# EAGLE design mh-z19b (EAGLE 9.6.2)
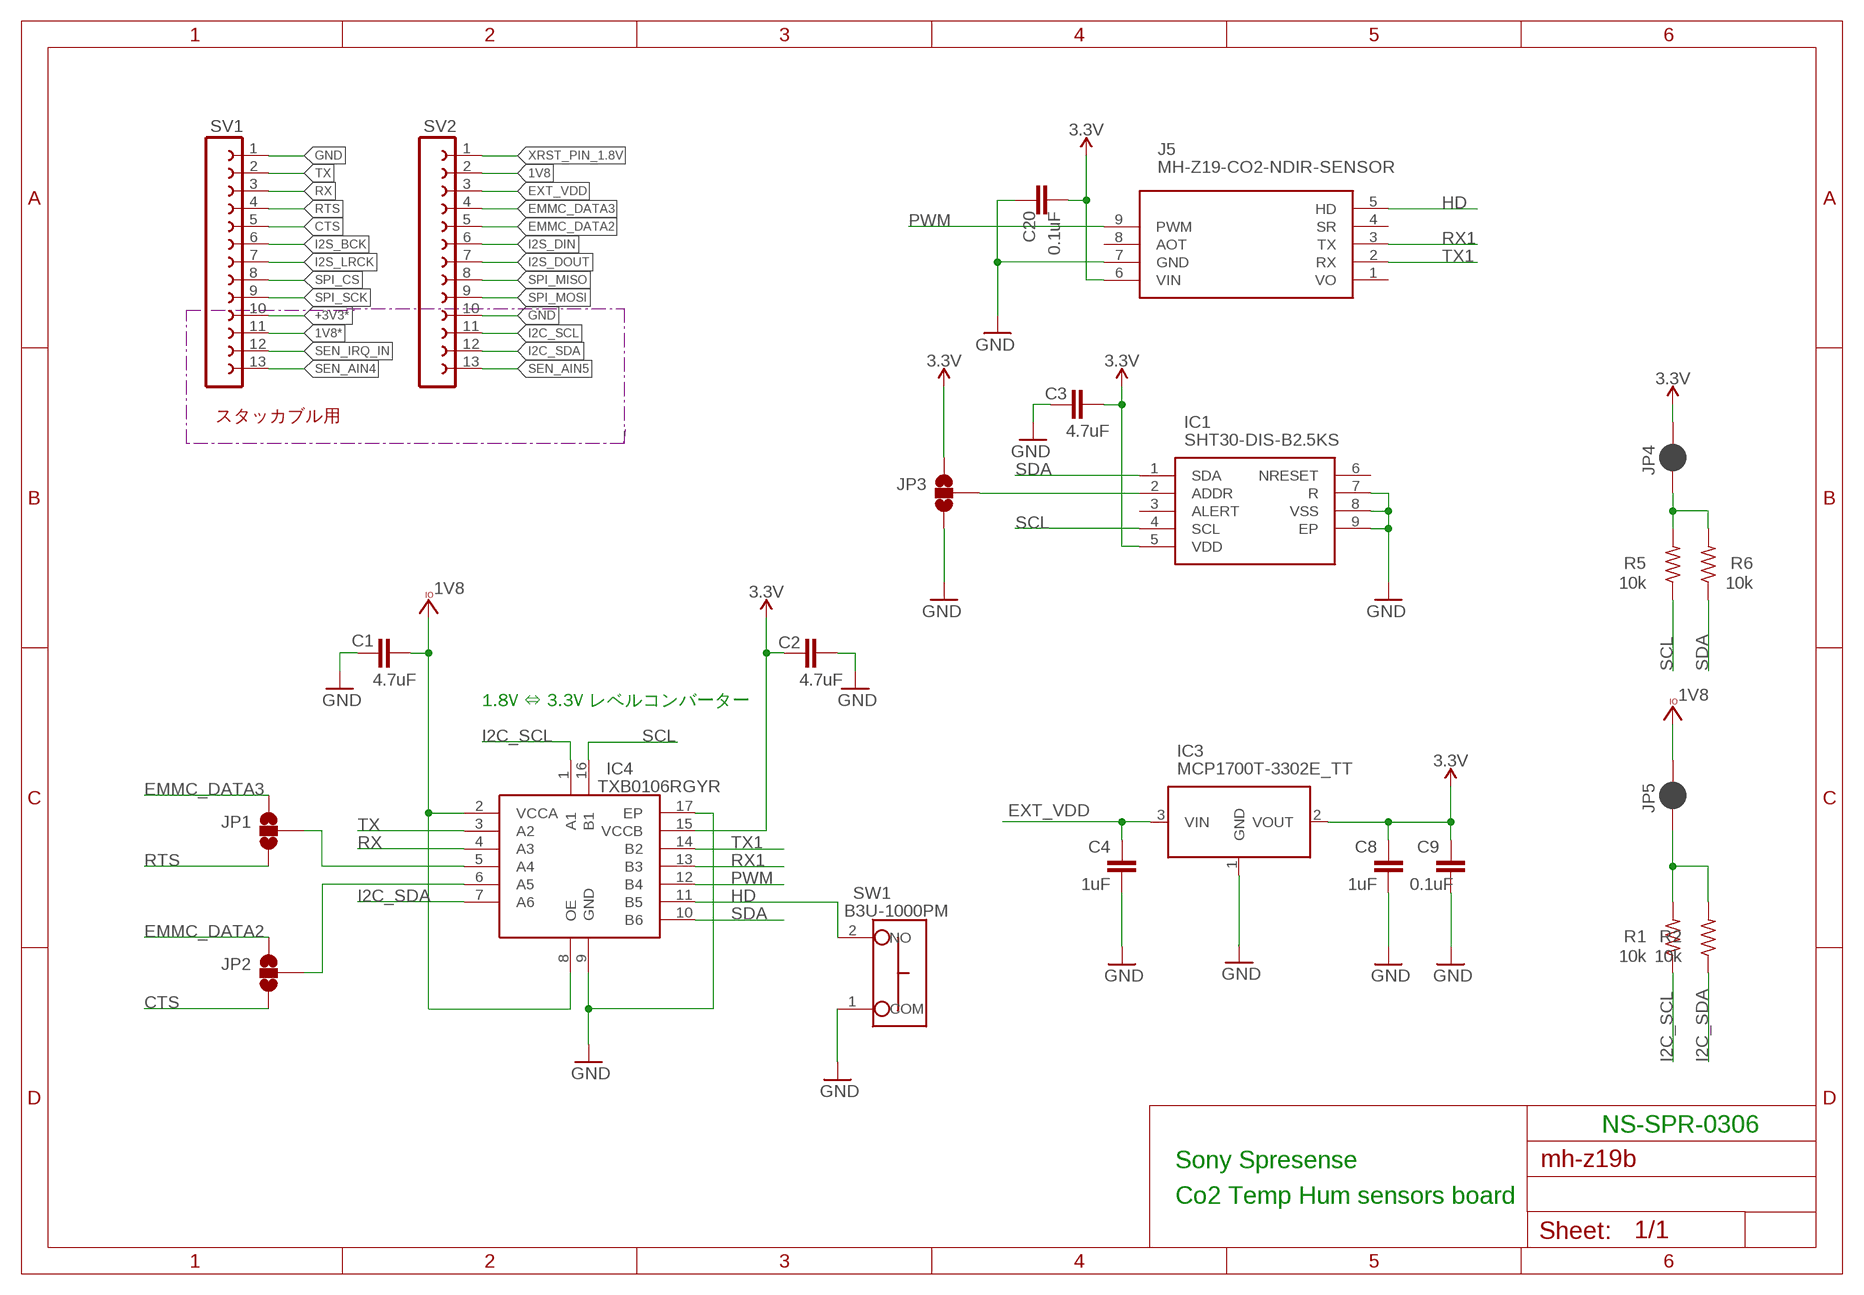
[diagram p0: schematic, sheet 1]

## Parts
C1  4.7uF  C-EUC0603K  [C0603K]
C2  4.7uF  C-EUC0603K  [C0603K]
C3  4.7uF  C-EUC0603K  [C0603K]
C4  1uF  C-EUC0603K  [C0603K]
C8  1uF  C-EUC0603K  [C0603K]
C9  0.1uF  C-EUC0603K  [C0603K]
C20  0.1uF  C-EUC0603K  [C0603K]
IC1  SHT30-DIS-B2.5KS  [SHT30DISB25KS]
IC3  MCP1700T-3302E_TT  [SOT95P237X112-3N]
IC4  TXB0106RGYR  [SN74CBT3257CRGYR]
J5  MH-Z19-CO2-NDIR-SENSOR  [MH-Z19]
JP1  JUMPER-SMT_3_NO_NO-SILK  [SMT-JUMPER_3_NO_NO-SILK]
JP2  JUMPER-SMT_3_NO_NO-SILK  [SMT-JUMPER_3_NO_NO-SILK]
JP3  JUMPER-SMT_3_NO_NO-SILK  [SMT-JUMPER_3_NO_NO-SILK]
JP4  JUMPER-SMT_2_NC_PASTE_NO-SILK  [SMT-JUMPER_2_NC_PASTE_NO-SILK]
JP5  JUMPER-SMT_2_NC_PASTE_NO-SILK  [SMT-JUMPER_2_NC_PASTE_NO-SILK]
R1  10k  R-US_R0603  [R0603]
R2  10k  R-US_R0603  [R0603]
R5  10k  R-US_R0603  [R0603]
R6  10k  R-US_R0603  [R0603]
SV1  FE13-1  [FE13]
SV2  FE13-1  [FE13]
SW1  B3U-1000PM  [B3U1000PM]

## Nets
1V8: C1.2 IC4.2(VCCA) IC4.8(OE) SV2.2
1V8*: SV1.11
3.3V: C2.1 C3.2 C8.1 C9.1 C20.2 IC1.5(VDD) IC3.2(VOUT) IC4.15(VCCB) J5.6(VIN) JP3.1 JP4.2
+3V3*: SV1.10
CTS: JP2.3 SV1.5
EMMC_DATA2: JP2.1 SV2.5
EMMC_DATA3: JP1.1 SV2.4
EXT_VDD: C4.1 IC3.3(VIN) SV2.3
GND: C1.1 C2.2 C3.1 C4.2 C8.2 C9.2 C20.1 IC1.7(R) IC1.8(VSS) IC1.9(EP) IC3.1(GND) IC4.9(GND) IC4.17(EP) J5.7(GND) JP3.3 SV1.1 SV2.10 SW1.1(COM)
HD: IC4.11(B5) J5.5(HD) SW1.2(NO)
I2C_SCL: IC4.1(A1) R1.1 SV2.11
I2C_SDA: IC4.7(A6) R2.1 SV2.12
I2S_BCK: SV1.6
I2S_DIN: SV2.6
I2S_DOUT: SV2.7
I2S_LRCK: SV1.7
N$1: IC4.5(A4) JP1.2
N$2: IC4.6(A5) JP2.2
N$4: JP4.1 R5.2 R6.2
N$5: JP5.1 R1.2 R2.2
N$7: IC1.2(ADDR) JP3.2
PWM: IC4.12(B4) J5.9(PWM)
RTS: JP1.3 SV1.4
RX: IC4.4(A3) SV1.3
RX1: IC4.13(B3) J5.3(TX)
SCL: IC1.4(SCL) IC4.16(B1) R5.1
SDA: IC1.1(SDA) IC4.10(B6) R6.1
SEN_AIN4: SV1.13
SEN_AIN5: SV2.13
SEN_IRQ_IN: SV1.12
SPI_CS: SV1.8
SPI_MISO: SV2.8
SPI_MOSI: SV2.9
SPI_SCK: SV1.9
TX: IC4.3(A2) SV1.2
TX1: IC4.14(B2) J5.2(RX)
VCCIO: JP5.2 ; supply symbol labelled 1V8
XRST_PIN_1.8V: SV2.1
Unconnected: IC1.3(ALERT) IC1.6(NRESET) J5.4(SR) J5.8(AOT)

## Notes on the sheet
- スタッカブル用
- 1.8V ⇔ 3.3V レベルコンバーター
- NS-SPR-0306
- Sony Spresense
- Co2 Temp Hum sensors board

## Power pins joined to a net without a drawn wire
VO: J5.1(VO)

## Library data of the parts
C1-C4 C8 C9 = rcl:C-EU: CAPACITOR, European symbol; SPICEPREFIX: C
C20 = resistor:C-EU: CAPACITOR, European symbol
IC1 = SamacSys_Parts:SHT30-DIS-B2.5KS: Humidity/Temperature Sensor Digital Serial (I2C) 8-Pin DFN EP T/R Source: Datasheet <https://media.digikey.com/pdf/Data Sheets/Sensirion PDFs/HT_DS_SHT3x_DIS.pdf>; DESCRIPTION: Humidity/Temperature Sensor Digital Serial (I2C) 8-Pin DFN EP T/R; HEIGHT: 1mm; MANUFACTURER_NAME: Sensirion AG; MANUFACTURER_PART_NUMBER: SHT30-DIS-B2.5KS
IC3 = SamacSys_Parts:MCP1700T-3302E_TT: LDO voltage regulator 250mA Isupply 1uA Source: Datasheet <https://componentsearchengine.com/Datasheets/1/MCP1700T-3302E_TT.pdf>; DESCRIPTION: LDO voltage regulator 250mA Isupply 1uA; HEIGHT: 1.12mm; MANUFACTURER_NAME: Microchip; MANUFACTURER_PART_NUMBER: MCP1700T-3302E/TT; MOUSER_PART_NUMBER: 579-MCP1700T3302E/TT; MOUSER_PRICE-STOCK: https://www.mouser.com/Search/Refine.aspx?Keyword=579-MCP1700T3302E%2FTT
IC4 = SamacSys_Parts:TXB0106RGYR: Translation - Voltage Levels 8B Bidirec Vltg-Lev Translator Source: Datasheet <https://www.ti.com/lit/gpn/TXB0106>; DESCRIPTION: Translation - Voltage Levels 8B Bidirec Vltg-Lev Translator; HEIGHT: mm; MANUFACTURER_NAME: Texas Instruments; MANUFACTURER_PART_NUMBER: TXB0106RGYR; MOUSER_PART_NUMBER: 595-TXB0106RGYR; MOUSER_PRICE-STOCK: https://www.mouser.co.uk/ProductDetail/Texas-Instruments/TXB0106RGYR?qs=XGzIaZb%2FFYLhB9Sk%252BZUXMA%3D%3D
J5 = mh-z19:MH-Z19: MH-Z19 - CO2 NDIR SENSOR
JP1-JP3 = SparkFun-Jumpers:JUMPER-SMT_3_NO: Normally open jumper This jumper has three pads in close proximity to each other. Apply solder to close the connection(s).
JP4 JP5 = SparkFun-Jumpers:JUMPER-SMT_2_NC_PASTE: Normally closed solder jumper This jumper has an aperture in the stencil to allow solder paste to bridge the split in the wire so it's normally closed (NC). Wick off the solder to open the connection. Reapply solder to reclose the connection.
R1 R2 R5 R6 = rcl:R-US_: RESISTOR, American symbol; SPICEPREFIX: R
SV1 SV2 = con-lsta:FE13-1: FEMALE HEADER; OC_FARNELL: unknown; OC_NEWARK: unknown
SW1 = SamacSys_Parts:B3U-1000PM: Tactile Switches Top Act. w/out Boss w/out Ground Term Source: Datasheet <https://componentsearchengine.com/Datasheets/1/B3U-1000PM.pdf>; ALLIED_NUMBER: 71559346; ALLIED_PRICE-STOCK: https://www.alliedelec.com/omronelectroniccomponents-b3u-1000pm/71559346/; DESCRIPTION: Tactile Switches Top Act. w/out Boss w/out Ground Term; HEIGHT: 1.75mm; MANUFACTURER_NAME: Omron Electronics; MANUFACTURER_PART_NUMBER: B3U-1000PM; MOUSER_PART_NUMBER: 653-B3U-1000PM; MOUSER_PRICE-STOCK: https://www.mouser.com/Search/Refine.aspx?Keyword=653-B3U-1000PM

## Net classes
0 default: width 0.203 mm

## Board
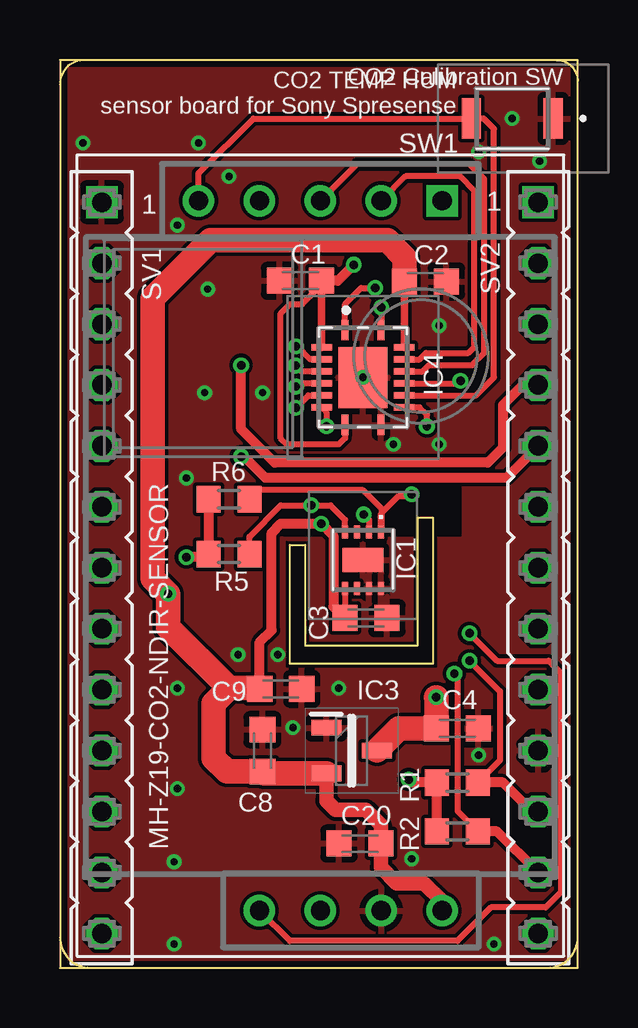
[diagram p1: board, top side]
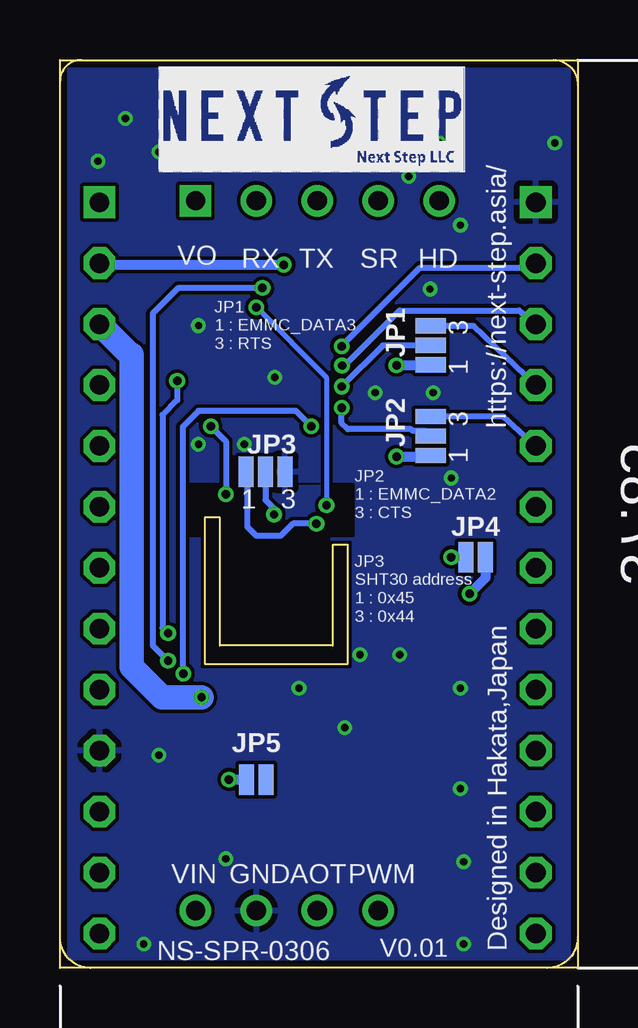
[diagram p2: board, bottom side, seen from below]

Size 21.59 x 37.85 mm. Coordinates in mm from the lower left corner, seen from the top.
Outline: 0,0 21.59,0 21.59,37.85 0,37.85 0,0
Copper layers (1*16): Top 0.035mm / dielectric 1.5mm / Bottom 0.035mm
Design rules "SeeedStudio_2layer_DRU_no_angle_20140221": minimum track width 6mil, minimum drill 12mil, track to track 6mil, track to pad 6mil, pad to pad 6mil, via to via 6mil, smd to smd 0mil, copper to edge 10mil, drill to drill 10mil, minimum pad ring 10mil, minimum via ring 6mil, stop-mask expansion 2mil, vias tented up to drill 100mil, thermal gap 10mil
tRestrict: 12 lines
bRestrict: 11 lines
Milling: 13 lines

### Footprints (pad centres in the part's own frame; a part is rotated, then mirrored left to right if it is on the bottom)
C0603K = smd 1.05 x 1.08: 1 -0.875,0; 2 0.875,0
SHT30DISB25KS = smd 0.55 x 0.25: 1 -1.175,0.75; 2 -1.175,0.25; 3 -1.175,-0.25; 4 -1.175,-0.75; 5 1.175,-0.75; 6 1.175,-0.25; 7 1.175,0.25; 8 1.175,0.75 | smd 1 x 1.7: 9 0,0
SOT95P237X112-3N = smd 1.25 x 0.65: 1 -1.05,0.95; 2 -1.05,-0.95; 3 1.05,0
SN74CBT3257CRGYR = smd 0.85 x 0.28: 1 -1.975,-0.75; 8 1.975,-0.75; 9 1.975,0.75; 16 -1.975,0.75 | smd 0.28 x 0.85: 2 -1.25,-1.725; 3 -0.75,-1.725; 4 -0.25,-1.725; 5 0.25,-1.725; 6 0.75,-1.725; 7 1.25,-1.725; 10 1.25,1.725; 11 0.75,1.725; 12 0.25,1.725; 13 -0.25,1.725; 14 -0.75,1.725; 15 -1.25,1.725 | smd 2.55 x 2.05: 17 0,0
MH-Z19 = drill 0.8 square: 1 29.591,0 | drill 0.8: 2 29.591,2.54; 3 29.591,5.08; 4 29.591,7.62; 5 29.591,10.16; 6 0,0; 7 0,2.54; 8 0,5.08; 9 0,7.62
SMT-JUMPER_3_NO_NO-SILK = smd 0.635 x 1.27: 1 -0.813,0; 2 0,0; 3 0.813,0
SMT-JUMPER_2_NC_PASTE_NO-SILK = smd 0.635 x 1.27: 1 -0.406,0; 2 0.406,0
R0603 = smd 1 x 1.1: 1 -0.85,0; 2 0.85,0
FE13 = drill 0.813 square: 1 -15.24,0 | drill 0.813 octagon: 2 -12.7,0; 3 -10.16,0; 4 -7.62,0; 5 -5.08,0; 6 -2.54,0; 7 0,0; 8 2.54,0; 9 5.08,0; 10 7.62,0; 11 10.16,0; 12 12.7,0; 13 15.24,0
B3U1000PM = smd 0.8 x 1.7: 1 1.7,0; 2 -1.7,0

### Placement (x,y rotation side)
C1  10.03,28.64 0 top
C2  15.24,28.61 0 top
C3  12.76,14.58 180 top
C4  16.57,9.98 0 top
C8  8.45,9.06 90 top
C9  9.21,11.63 0 top
C20  12.51,5.18 0 top
IC1  12.64,16.99 270 top
IC3  12.16,9.06 0 top
IC4  12.64,24.61 270 top
J5  15.94,2.39 90 top
JP1  6.13,25.95 90 bottom
JP2  6.13,22.17 90 bottom
JP3  13.02,20.68 0 bottom
JP4  4.25,17.12 0 bottom
JP5  13.4,7.85 0 bottom
R1  16.57,7.72 180 top
R2  16.57,5.69 180 top
R5  7.05,17.25 180 top
R6  7.05,19.53 180 top
SV1  1.75,16.68 270 top
SV2  19.94,16.68 270 top
SW1  18.86,35.41 0 top

### Tracks (layer width: path | path; a pad name or v marks a point on that pad's centre or on a via)
1V8  (via drill 0.35)
  Top 0.254: IC4.8 11.89,22.08 11.62,21.82 9.46,21.82 9.21,22.07 9.21,27.28 9.59,27.66 10.1,27.66 10.91,28.48 C1.2
  Top 0.305: IC4.2 C1.2
  Top 0.406: C1.2 11.59,28.64 v12.26,29.31
  Bottom 0.406: SV2.2 19.88,29.31 v12.26,29.31
3.3V  (via drill 0.35)
  Top 0.254: IC1.5 C3.2
  Top 0.305: IC4.15 C2.1
  Top 0.406: C2.1 | C9.1 8.33,13.58 8.83,14.07 8.83,18.14 9.21,18.52 v10.9,18.52 11.4,18.01 11.4,15.05 11.87,14.58 C3.2
  Top 0.61: IC3.2 11.11,6.96 11.49,6.58 12.76,6.58 13.38,5.96 C20.2 13.38,4.18 14.03,3.53 15.18,3.53 15.94,2.77 J5.6
  Top 1.016: IC3.2 8.52,8.11 C8.1 6.97,8.18 6.41,8.74 6.41,11.02 7.05,11.66 | C2.1 14.36,29.62 13.65,30.33 6.29,30.33 3.87,27.91 3.87,16.23 v4.51,15.6 4.51,14.2 7.05,11.66 | 7.05,11.66 8.3,11.66 C9.1
  Bottom 0.254: v10.9,18.52 11.87,18.52 12.38,18.01 13.4,18.01 13.78,18.39 13.78,20.62 JP3.1
  Bottom 0.406: JP4.2 3.85,16.26 v4.51,15.6
CTS
  Bottom 0.254: SV1.5 3.1,22.98 JP2.3
EMMC_DATA2  (via drill 0.35)
  Top 0.406: SV2.5 18.61,20.42 8.57,20.42 7.68,21.31 v7.56,21.31
  Bottom 0.406: v7.56,21.31 6.17,21.31 JP2.1
EMMC_DATA3  (via drill 0.35)
  Top 0.406: SV2.4 19.3,24.3 18.48,23.47 18.48,21.69 17.84,21.06 8.95,21.06 7.56,22.45 v7.56,25.12
  Bottom 0.406: v7.56,25.12 6.14,25.12 JP1.1
EXT_VDD  (via drill 0.35)
  Top 1.016: v15.68,11.28 15.7,11.26 C4.1 14.13,9.98 IC3.3
  Bottom 1.016: SV2.3 18.67,25.56 18.61,25.56 18.61,12.55 17.34,11.28 v15.68,11.28
GND  (via drill 0.3)
  other vias: 17.46,8.86 13.91,21.82 12.64,24.61 15.81,26.77 15.81,21.82 20,33.63 17.46,34.01 7.05,32.99 5.78,34.39 0.95,34.39 4.89,30.96 6.16,28.3 6.03,23.98 8.45,23.98 5.27,20.42 7.43,13.06 4.89,11.66 11.62,11.66 4.89,7.47 4.76,4.42 4.76,0.99 14.67,4.55 18.1,0.99 18.86,35.41 9.08,13.06 9.72,10.01
  pour Top: 0.06,37.82 21.65,37.82 21.65,-0.09 0.06,-0.09
  pour Bottom: 0.06,37.82 21.65,37.82 21.65,-0.03 0.06,-0.03
HD
  Top 0.254: J5.5 5.78,33.12 8.06,35.41 SW1.2 17.67,35.41 18.1,34.98 18.1,24.61 17.35,23.86 IC4.11
I2C_SCL  (via drill 0.35)
  Top 0.254: IC4.1 11.89,27.67 12.55,28.34 v13.14,28.34 | v17.08,12.8 18.35,11.53 18.35,8.65 R1.1
  Top 0.406: SV2.11 19.68,6.52 18.48,7.72 R1.1
  Bottom 0.254: v13.14,28.34 16.66,28.34 17.72,27.28 17.72,13.44 v17.08,12.8
I2C_SDA  (via drill 0.35)
  Top 0.254: IC4.7 11.11,23.16 v11.11,22.58 | v16.45,12.27 16.57,12.14 16.57,6.54 R2.1
  Top 0.406: SV2.12 18.22,5.69 R2.1
  Bottom 0.254: v11.11,22.58 11.75,23.22 15.81,23.22 16.47,22.55 16.47,12.29 v16.45,12.27
N$1  (via drill 0.35)
  Top 0.254: IC4.5 9.97,24.36 v9.84,24.23
  Bottom 0.254: JP1.2 8.13,25.95 v9.84,24.23
N$2  (via drill 0.35)
  Top 0.254: v9.84,23.34 10.36,23.86 IC4.6
  Bottom 0.254: JP2.2 6.34,22.38 6.88,22.38 6.95,22.45 9.59,22.45 9.84,22.71 v9.84,23.34
N$4  (via drill 0.35)
  Top 0.406: R6.2 R5.2 6.07,17.12 v5.27,17.12
  Bottom 0.406: v5.27,17.12 JP4.1
N$5  (via drill 0.35)
  Top 0.406: R2.2 R1.2 14.67,7.72 v14.54,7.85
  Bottom 0.406: v14.54,7.85 JP5.1
N$7  (via drill 0.35)
  Top 0.254: v12.66,18.9 12.89,18.68 IC1.2
  Bottom 0.254: JP3.2 13.02,19.5 12.66,19.15 v12.66,18.9
PWM  (via drill 0.35)
  Top 0.254: IC4.12 16.59,24.36 v16.7,24.47 | v17.08,13.94 18.22,12.8 20.38,12.8 20.89,12.29 20.89,3.15 20.26,2.51 17.97,2.51 16.57,1.12 9.59,1.12 J5.9
  Bottom 0.254: v16.7,24.47 16.7,23.66 17.31,23.05 17.31,14.17 v17.08,13.94
RTS
  Bottom 0.254: SV1.4 4.34,26.76 JP1.3
RX  (via drill 0.35)
  Top 0.254: IC4.4 10.07,24.86 v9.83,25.11
  Bottom 0.254: v9.83,25.11 9.73,25.11 7.43,27.41 2.44,27.41 SV1.3
RX1
  Top 0.254: IC4.13 15.12,24.86 15.38,25.12 17.18,25.12 17.69,25.63 17.69,32.89 17.08,33.5 12.38,33.5 J5.3
SCL  (via drill 0.35)
  Top 0.254: IC1.4 11.89,18.68 11.28,19.28 v10.48,19.28 9.21,19.28 7.9,17.97 R5.1 | v13.4,27.53 13.4,26.6 IC4.16
  Bottom 0.203: v13.4,27.53 10.48,24.61 v10.48,19.28
SDA  (via drill 0.35)
  Top 0.254: R6.1 8.28,19.91 12.64,19.91 13.4,19.15 13.4,18.18 IC1.1 13.39,18.93 14.12,19.66 14.75,19.66 v14.67,19.74 | v15.3,22.58 15.3,23.06 15,23.36 IC4.10
  Bottom 0.254: v14.67,19.74 14.67,21.95 v15.3,22.58
TX  (via drill 0.35)
  Top 0.254: IC4.3 10.43,25.36 9.88,25.91 v9.84,25.91
  Bottom 0.254: v9.84,25.91 6.57,29.18 1.81,29.18 SV1.2
TX1
  Top 0.254: IC4.14 15,25.36 15.26,25.63 17.03,25.63 17.28,25.88 17.28,32.38 16.68,32.99 14.41,32.99 J5.2

### Text on the board
tPlace: CO2 TEMP HUM / sensor board for Sony Spresense | CO2 Calibration SW | 1 | 1
bPlace: https://next-step.asia/ | VO | HD | SR | TX | RX | 3 | 1 | JP1 / 1 : EMMC_DATA3 / 3 : RTS | 3 | 1 | JP2 / 1 : EMMC_DATA2 / 3 : CTS | 3 | 1 | Designed in Hakata,Japan | JP3 / SHT30 address / 1 : 0x45 / 3 : 0x44 | PWM | AOT | GND | VIN | V0.01 | NS-SPR-0306